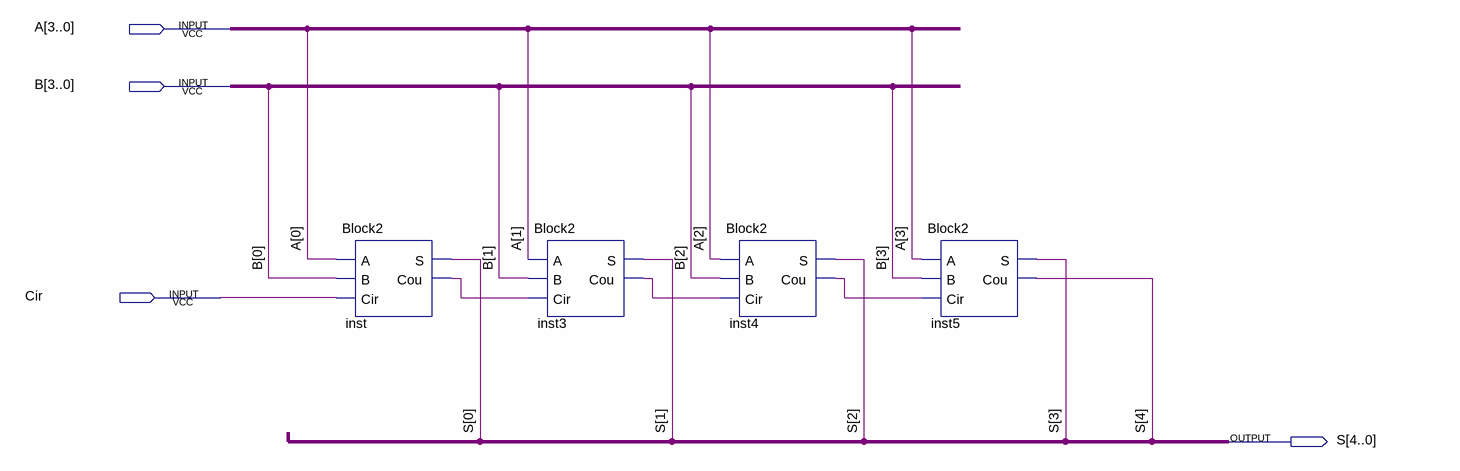
[diagram p0: schematic sheet]
// Quartus schematic Practica2_1.bdf as structural Verilog: 4 symbols, 4 pins
module Practica2_1 (
  input  [3:0] A,
  input  [3:0] B,
  input  Cir,
  output [4:0] S
);

  wire inst3_cou, inst4_cou, inst_cou;

  Block2 inst (.A(A[0]), .B(B[0]), .Cir(Cir), .S(S[0]), .Cou(inst_cou));
  Block2 inst3 (.A(A[1]), .B(B[1]), .Cir(inst_cou), .S(S[1]), .Cou(inst3_cou));
  Block2 inst4 (.A(A[2]), .B(B[2]), .Cir(inst3_cou), .S(S[2]), .Cou(inst4_cou));
  Block2 inst5 (.A(A[3]), .B(B[3]), .Cir(inst4_cou), .S(S[3]), .Cou(S[4]));
endmodule
